# EAGLE schematic TurboMaster (EAGLE 7.6.0)
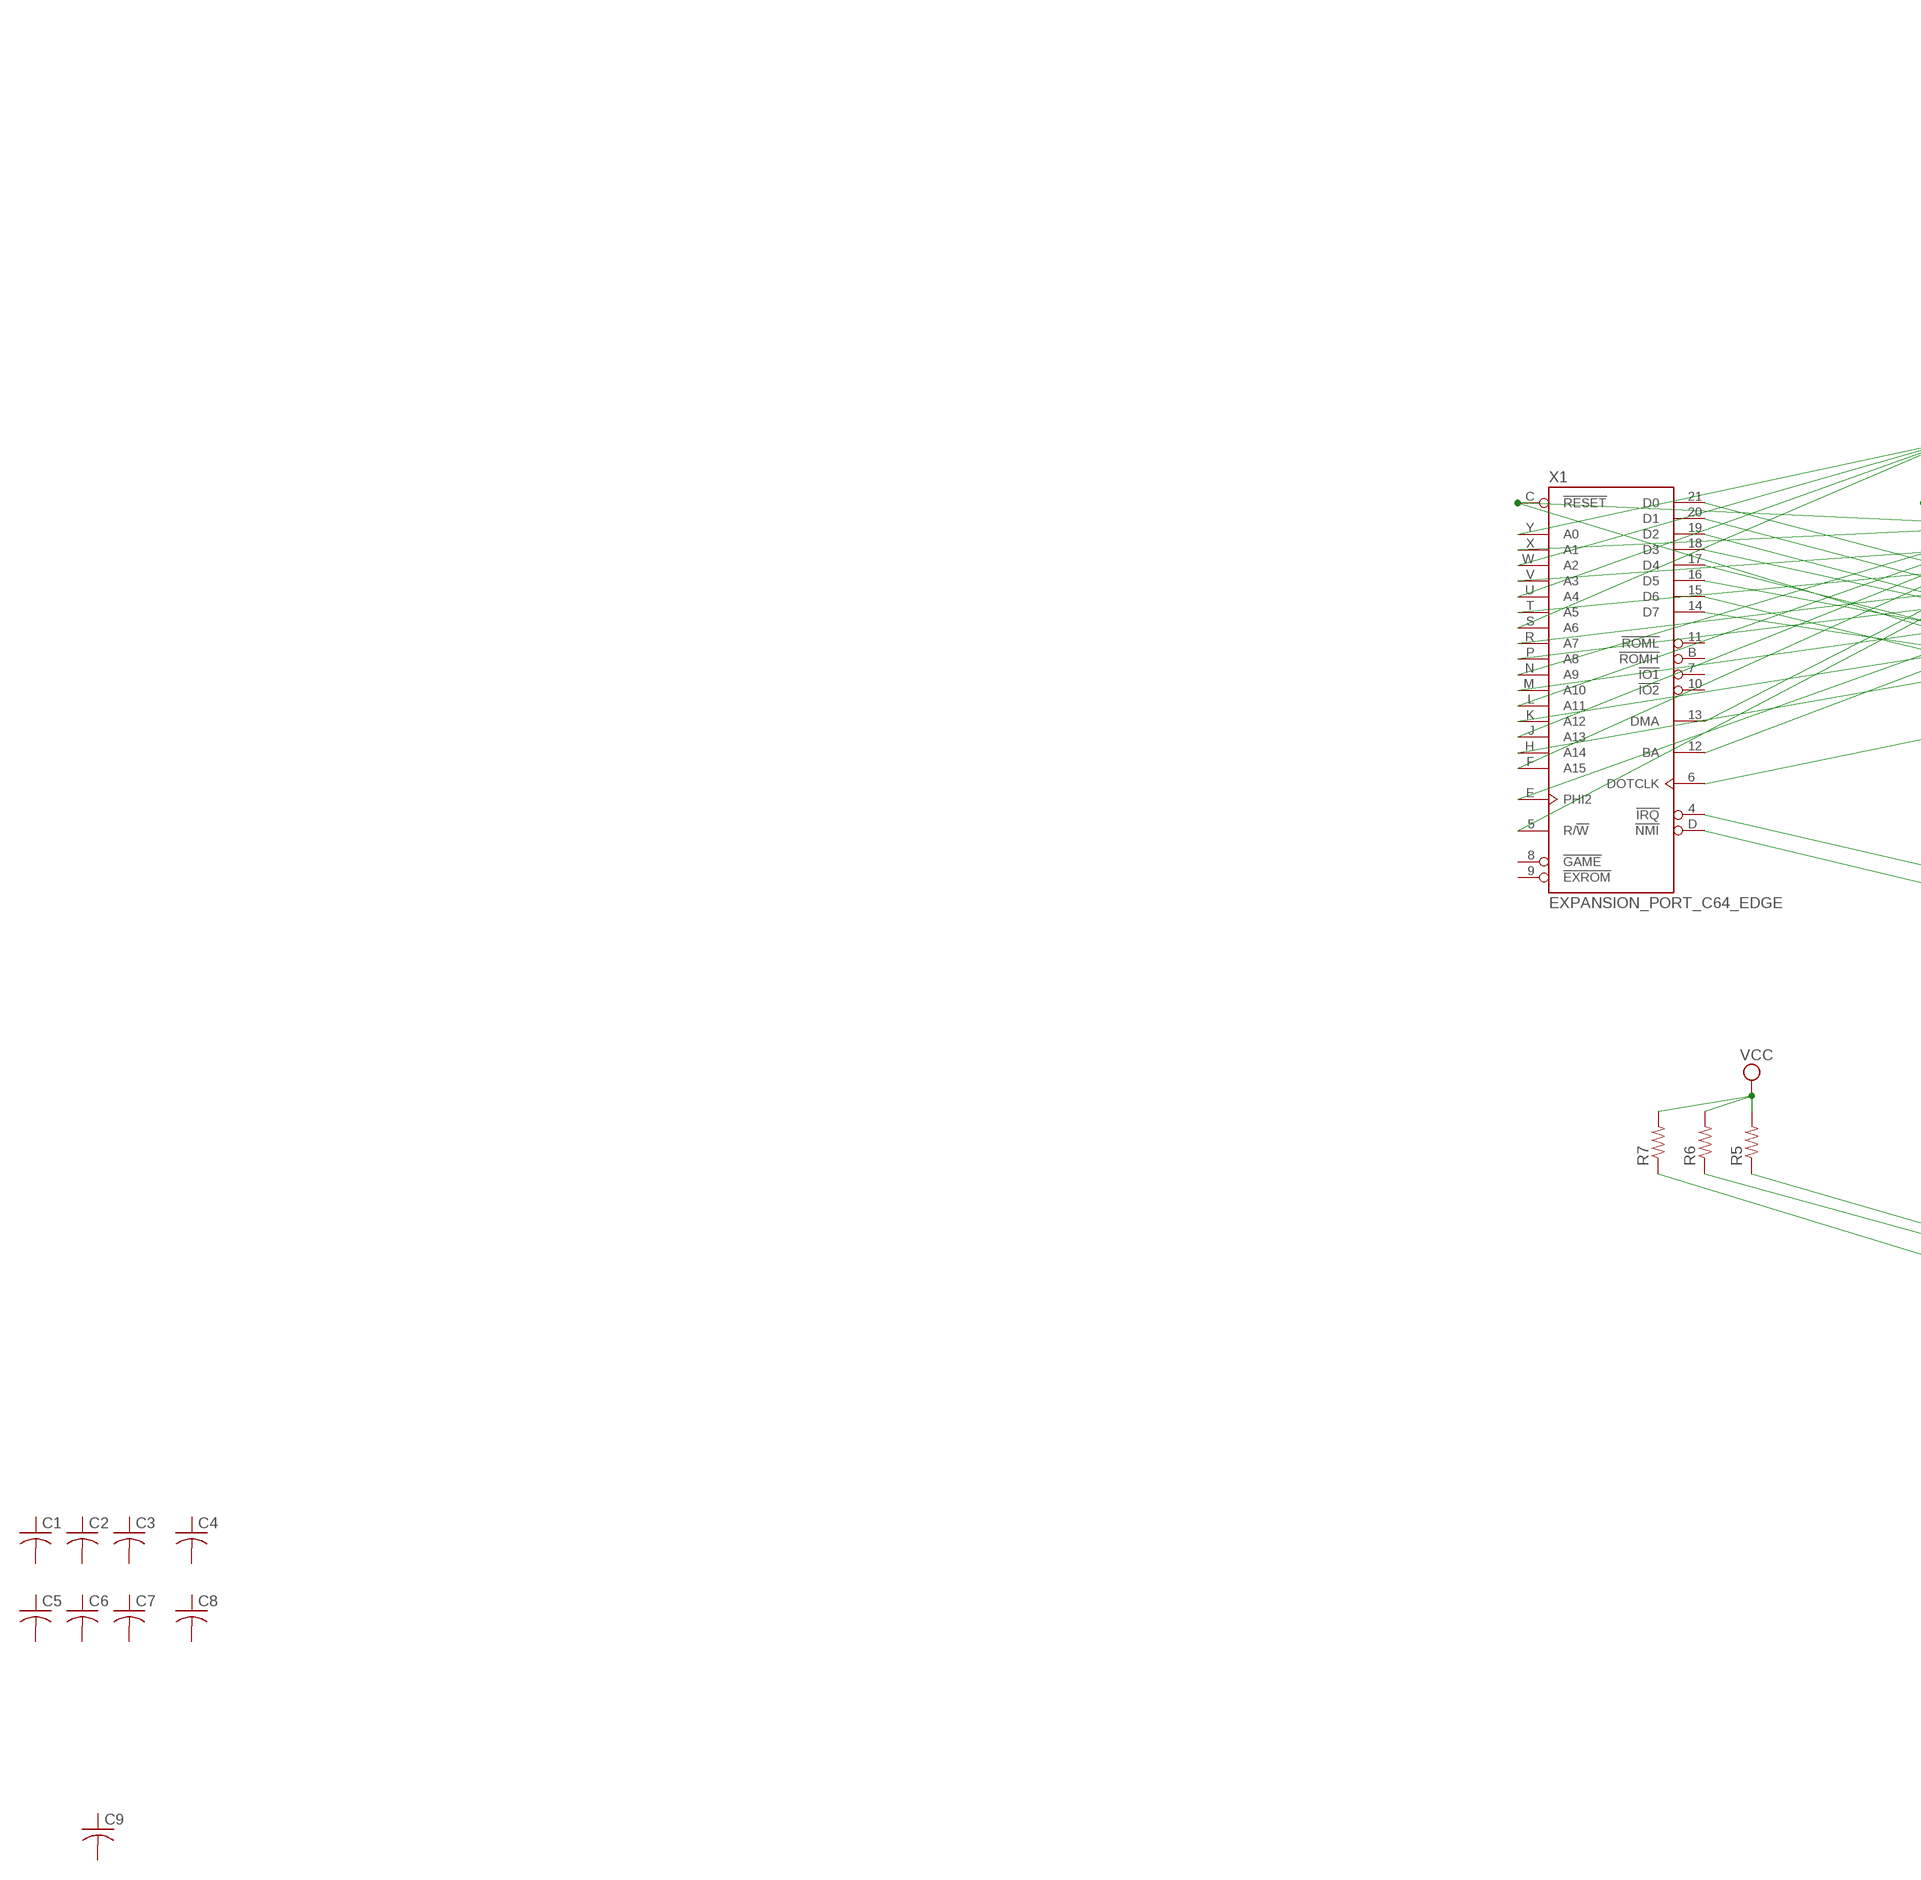
[diagram p0: schematic, sheet 1, part 1 of 2]
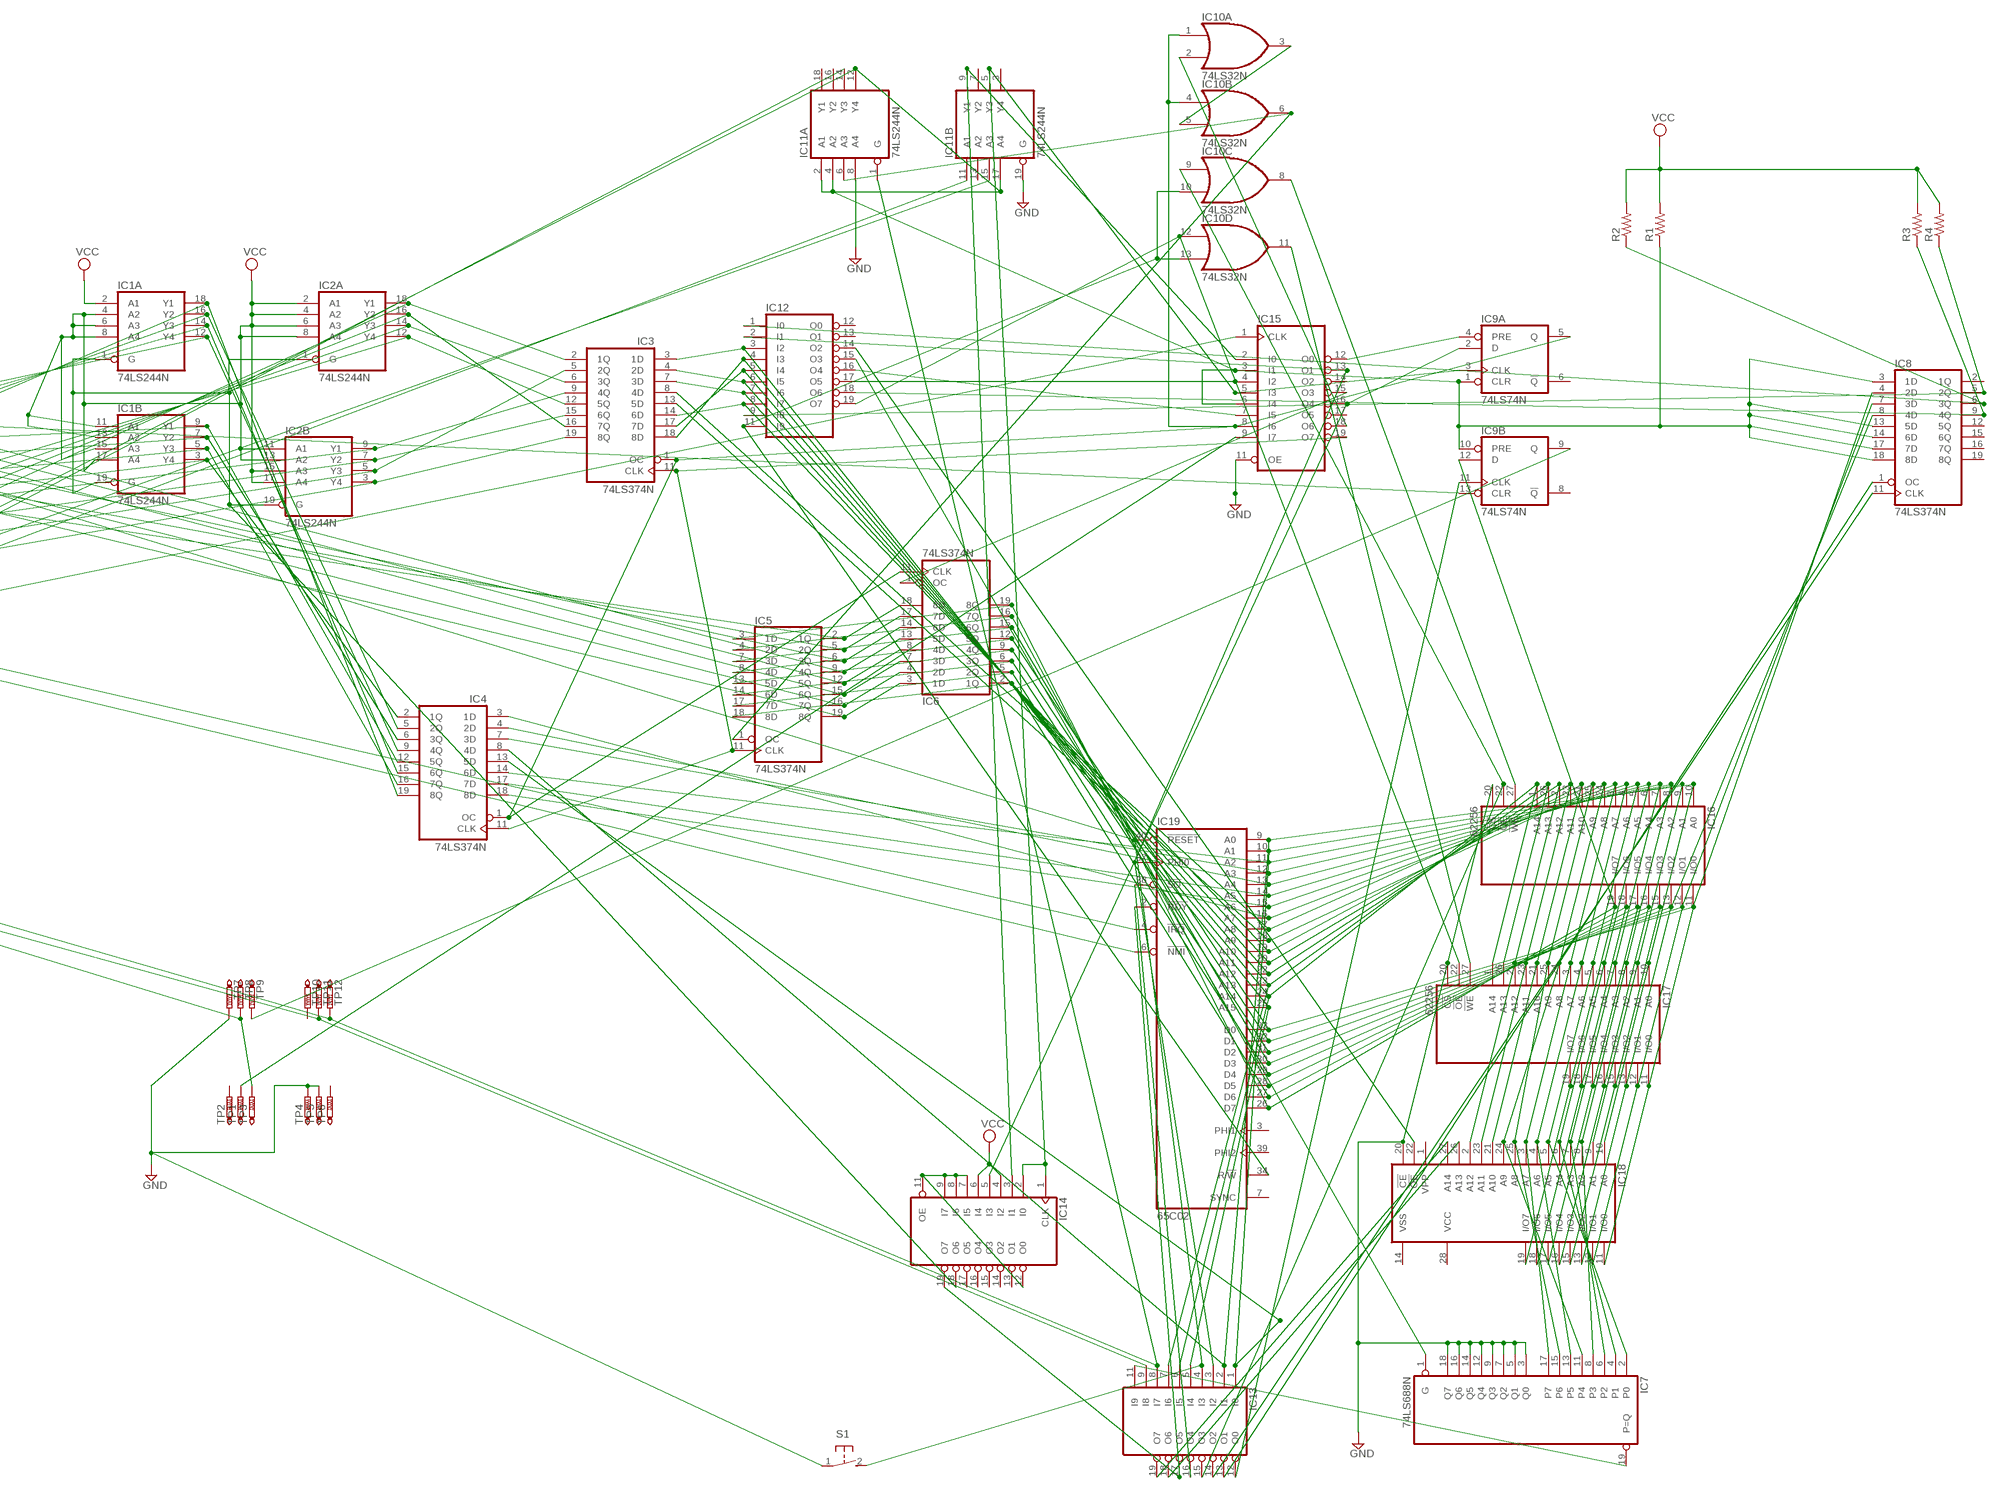
[diagram p1: schematic, sheet 1, part 2 of 2]

## Parts
C1  C-US050-024X044  [C050-024X044]
C2  C-US050-024X044  [C050-024X044]
C3  C-US050-024X044  [C050-024X044]
C4  C-US050-024X044  [C050-024X044]
C5  C-US050-024X044  [C050-024X044]
C6  C-US050-024X044  [C050-024X044]
C7  C-US050-024X044  [C050-024X044]
C8  C-US050-024X044  [C050-024X044]
C9  C-US050-024X044  [C050-024X044]
IC1  74LS244N  [DIL20]
IC2  74LS244N  [DIL20]
IC3  74LS374N  [DIL20]
IC4  74LS374N  [DIL20]
IC5  74LS374N  [DIL20]
IC6  74LS374N  [DIL20]
IC7  74LS688N  [DIL20]
IC8  74LS374N  [DIL20]
IC9  74LS74N  [DIL14]
IC10  74LS32N  [DIL14]
IC11  74LS244N  [DIL20]
IC12  16L8  [DIL20]
IC13  16L8  [DIL20]
IC14  16R4  [DIL20]
IC15  16R6  [DIL20]
IC16  62256  [DIL28]
IC17  62256  [DIL28]
IC18  27C256AG  [DIL28-6]
IC19  65C02  [DIL40]
R1  R-US_0207/10  [0207/10]
R2  R-US_0207/10  [0207/10]
R3  R-US_0207/10  [0207/10]
R4  R-US_0207/10  [0207/10]
R5  R-US_0207/10  [0207/10]
R6  R-US_0207/10  [0207/10]
R7  R-US_0207/10  [0207/10]
S1  31-XX  [B3F-31XX]
TP1  PTR1PAD1-13  [P1-13]
TP2  PTR1PAD1-13  [P1-13]
TP3  PTR1PAD1-13  [P1-13]
TP4  PTR1PAD1-13  [P1-13]
TP5  PTR1PAD1-13  [P1-13]
TP6  PTR1PAD1-13  [P1-13]
TP7  PTR1PAD1-13  [P1-13]
TP8  PTR1PAD1-13  [P1-13]
TP9  PTR1PAD1-13  [P1-13]
TP10  PTR1PAD1-13  [P1-13]
TP11  PTR1PAD1-13  [P1-13]
TP12  PTR1PAD1-13  [P1-13]
X1  EXPANSION_PORT_C64_EDGE  [MA100-22-2]

## Nets
GND: IC7.3(Q0) IC7.5(Q1) IC7.7(Q2) IC7.9(Q3) IC7.12(Q4) IC7.14(Q5) IC7.16(Q6) IC7.18(Q7) IC11.8(A:A4) IC11.19(B:G) IC15.11(OE) IC16.20(!CS) IC17.20(!CS) IC18.20(!CE) S1.1(P) TP4.TP TP5.TP TP7.TP
N$1: IC1.1(A:G) IC1.19(B:G) IC2.1(A:G) IC2.19(B:G) IC14.18(O6)
N$2: IC3.14(6D) IC12.8(I7) IC16.21(A10) IC17.21(A10) IC18.21(A10) IC19.19(A10)
N$3: IC13.17(O5) IC14.19(O7) IC19.2(!RDY)
N$4: IC8.11(CLK) IC13.14(O2)
N$5: IC8.9(4Q) IC12.18(O6) R3.1
N$6: IC4.3(1D) IC7.17(P7) IC16.3(A7) IC17.3(A7) IC18.3(A7) IC19.16(A7)
N$7: IC4.18(8D) IC7.13(P5) IC16.4(A6) IC17.4(A6) IC18.4(A6) IC19.15(A6)
N$8: IC3.8(4D) IC7.15(P6) IC16.25(A9) IC17.25(A9) IC18.25(A8) IC19.17(A8)
N$9: IC4.17(7D) IC7.2(P0) IC16.5(A5) IC17.5(A5) IC18.5(A5) IC19.14(A5)
N$10: IC4.4(2D) IC7.4(P1) IC16.6(A4) IC17.6(A4) IC18.6(A4) IC19.13(A4)
N$11: IC4.7(3D) IC7.6(P2) IC16.7(A3) IC17.7(A3) IC18.7(A3) IC19.12(A3)
N$12: IC4.14(6D) IC7.8(P3) IC16.8(A2) IC17.8(A2) IC18.8(A2) IC19.11(A2)
N$13: IC4.13(5D) IC13.1(I0) IC16.9(A1) IC17.9(A1) IC18.9(A1) IC19.10(A1)
N$14: IC4.8(4D) IC13.2(I1) IC16.10(A0) IC17.10(A0) IC18.10(A0) IC19.9(A0)
N$15: IC5.8(4D) IC6.12(5Q) IC8.4(2D) IC16.11(I/O0) IC17.11(I/O0) IC18.11(I/O0) IC19.33(D0)
N$16: IC5.13(5D) IC6.9(4Q) IC8.7(3D) IC16.12(I/O1) IC17.12(I/O1) IC18.12(I/O1) IC19.32(D1)
N$17: IC5.14(6D) IC6.6(3Q) IC8.8(4D) IC16.13(I/O2) IC17.13(I/O2) IC18.13(I/O2) IC19.31(D2)
N$18: IC5.7(3D) IC6.15(6Q) IC16.15(I/O3) IC17.15(I/O3) IC18.15(I/O3) IC19.30(D3)
N$19: IC5.17(7D) IC6.5(2Q) IC16.16(I/O4) IC17.16(I/O4) IC18.16(I/O4) IC19.29(D4)
N$20: IC5.4(2D) IC6.16(7Q) IC16.17(I/O5) IC17.17(I/O5) IC18.17(I/O5) IC19.28(D5)
N$21: IC5.18(8D) IC6.2(1Q) IC16.18(I/O6) IC17.18(I/O6) IC18.18(I/O6) IC19.27(D6)
N$22: IC5.3(1D) IC6.19(8Q) IC9.12(B:D) IC16.19(I/O7) IC17.19(I/O7) IC18.19(I/O7) IC19.26(D7)
N$23: IC13.18(O6) IC18.26(A13)
N$26: IC3.13(5D) IC7.11(P4) IC16.24(A8) IC17.24(A8) IC18.24(A9) IC19.18(A9)
N$27: IC8.5(2Q) IC12.9(I8) R4.1
N$28: IC13.19(O7) IC18.27(A14)
N$29: IC9.13(B:CLR) IC13.4(I3) IC19.40(!RESET) S1.2(S) X1.C(!RESET)
N$30: IC13.16(O4) IC19.38(!SO)
N$31: IC12.2(I1) IC13.3(I2) IC15.13(O1) IC19.37(PHI0)
N$32: IC5.12(5Q) IC6.8(4D) X1.20(D1)
N$33: IC10.9(C:I0) IC13.15(O3) IC16.22(!OE)
N$34: IC1.12(A:Y4) IC4.9(4Q) X1.Y(A0)
N$35: IC1.9(B:Y1) IC4.12(5Q) X1.X(A1)
N$36: IC1.14(A:Y3) IC4.15(6Q) X1.W(A2)
N$37: IC1.7(B:Y2) IC4.6(3Q) X1.V(A3)
N$38: IC1.16(A:Y2) IC4.5(2Q) X1.U(A4)
N$39: IC1.5(B:Y3) IC4.16(7Q) X1.T(A5)
N$40: IC1.18(A:Y1) IC4.19(8Q) X1.S(A6)
N$41: IC1.3(B:Y4) IC4.2(1Q) X1.R(A7)
N$42: IC2.9(B:Y1) IC3.9(4Q) X1.P(A8)
N$43: IC2.12(A:Y4) IC3.12(5Q) X1.N(A9)
N$44: IC2.7(B:Y2) IC3.15(6Q) X1.M(A10)
N$45: IC2.14(A:Y3) IC3.6(3Q) X1.L(A11)
N$46: IC2.5(B:Y3) IC3.5(2Q) X1.K(A12)
N$47: IC2.16(A:Y2) IC3.16(7Q) X1.J(A13)
N$48: IC2.3(B:Y4) IC3.19(8Q) X1.H(A14)
N$49: IC2.18(A:Y1) IC3.2(1Q) X1.F(A15)
N$50: IC11.15(B:A3) X1.E(PHI2)
N$51: IC19.6(!NMI) X1.D(!NMI)
N$52: R7.1 TP3.TP TP8.TP
N$53: IC19.4(!IRQ) X1.4(!IRQ)
N$54: IC11.14(A:Y3) X1.5(R/!W)
N$55: IC15.1(CLK) X1.6(DOTCLK)
N$56: IC11.11(B:A1) X1.12(BA)
N$57: IC8.3(1D) IC8.13(5D) IC8.14(6D) IC8.17(7D) IC8.18(8D) IC9.1(A:CLR) IC9.10(B:PRE) IC11.2(A:A1) IC11.4(A:A2) IC11.12(A:Y4) IC11.17(B:A4) IC15.3(I1) IC15.6(I4) R1.1 X1.13(DMA)
N$58: IC5.2(1Q) IC6.18(8D) X1.14(D7)
N$59: IC5.19(8Q) IC6.3(1D) X1.15(D6)
N$60: IC5.5(2Q) IC6.17(7D) X1.16(D5)
N$61: IC5.16(7Q) IC6.4(2D) X1.17(D4)
N$62: IC5.6(3Q) IC6.14(6D) X1.18(D3)
N$63: IC5.15(6Q) IC6.7(3D) X1.19(D2)
N$64: IC5.9(4Q) IC6.13(5D) X1.21(D0)
N$65: IC10.3(A:O) IC10.5(B:I1)
N$66: IC5.1(OC) IC10.6(B:O) IC11.6(A:A3)
N$67: IC10.8(C:O) IC16.27(!WE)
N$68: IC10.10(C:I1) IC10.13(D:I1) IC12.11(I9) IC19.34(R/!W)
N$69: IC10.11(D:O) IC17.27(!WE)
N$70: IC11.9(B:Y1) IC14.3(I1) IC15.2(I0)
N$71: IC3.1(OC) IC4.1(OC) IC6.11(CLK) IC9.5(A:Q) IC10.1(A:I0) IC10.4(B:I0) IC15.8(I6)
N$72: IC10.2(A:I1) IC15.18(O6)
N$73: IC9.2(A:D) IC14.5(I3) IC15.16(O4)
N$74: IC10.12(D:I0) IC12.17(O5) IC12.19(O7) IC17.22(!OE)
N$75: IC9.4(A:PRE) IC15.12(O0)
N$76: IC6.1(OC) IC15.15(O3)
N$77: IC9.3(A:CLK) IC11.5(B:Y3) IC14.1(CLK) IC14.2(I0) IC15.5(I3)
N$78: IC12.16(O4) IC15.7(I5)
N$79: IC8.6(3Q) IC12.1(I0) R2.1
N$80: IC15.9(I7) TP1.TP
N$81: IC3.7(3D) IC12.7(I6) IC16.23(A11) IC17.23(A11) IC18.23(A11) IC19.20(A11)
N$82: IC8.1(OC) IC13.13(O1)
N$83: IC7.19(P=Q) IC13.11(I9)
N$84: IC7.1(G) IC12.15(O3)
N$85: IC3.3(1D) IC12.3(I2) IC13.5(I4) IC19.25(A15)
N$86: IC3.18(8D) IC12.4(I3) IC13.6(I5) IC16.1(A14) IC17.1(A14) IC19.24(A14)
N$87: IC3.17(7D) IC12.5(I4) IC13.7(I6) IC16.26(A13) IC17.26(A13) IC19.23(A13)
N$88: IC3.4(2D) IC12.6(I5) IC16.2(A12) IC17.2(A12) IC18.2(A12) IC19.22(A12)
N$89: IC9.11(B:CLK) IC13.12(O0)
N$90: IC14.7(I5) IC14.8(I6) IC14.9(I7) IC14.11(OE) IC14.12(O0)
N$91: IC13.9(I8) R6.1 TP11.TP
N$92: IC9.9(B:Q) TP9.TP
N$93: IC11.1(A:G) IC13.8(I7) R5.1 TP12.TP
N$94: IC3.11(CLK) IC4.11(CLK) IC5.11(CLK) IC15.19(O7)
N$95: IC12.14(O2) IC18.22(!OE)
VCC: IC1.2(A:A1) IC1.4(A:A2) IC1.6(A:A3) IC1.8(A:A4) IC1.11(B:A1) IC1.13(B:A2) IC1.15(B:A3) IC1.17(B:A4) IC2.2(A:A1) IC2.4(A:A2) IC2.6(A:A3) IC2.8(A:A4) IC2.11(B:A1) IC2.13(B:A2) IC2.15(B:A3) IC2.17(B:A4) IC14.4(I2) IC14.6(I4) R1.2 R2.2 R3.2 R4.2 R5.2 R6.2 R7.2
Unconnected: C1.1 C1.2 C2.1 C2.2 C3.1 C3.2 C4.1 C4.2 C5.1 C5.2 C6.1 C6.2 C7.1 C7.2 C8.1 C8.2 C9.1 C9.2 IC8.2(1Q) IC8.12(5Q) IC8.15(6Q) IC8.16(7Q) IC8.19(8Q) IC9.6(A:!Q) IC9.8(B:!Q) IC11.3(B:Y4) IC11.7(B:Y2) IC11.13(B:A2) IC11.16(A:Y2) IC11.18(A:Y1) IC12.12(O0) IC12.13(O1) IC14.13(O1) IC14.14(O2) IC14.15(O3) IC14.16(O4) IC14.17(O5) IC15.4(I2) IC15.14(O2) IC15.17(O5) IC18.1(VPP) IC19.3(PHI1) IC19.7(SYNC) IC19.39(PHI2) TP2.TP TP6.TP TP10.TP X1.7(!IO1) X1.8(!GAME) X1.9(!EXROM) X1.10(!IO2) X1.11(!ROML) X1.B(!ROMH)

## Power pins joined to a net without a drawn wire
GND: IC1.10(P:GND) IC2.10(P:GND) IC3.10(GND) IC4.10(GND) IC5.10(GND) IC6.10(GND) IC7.10(GND) IC8.10(GND) IC9.7(P:GND) IC10.7(P:GND) IC11.10(P:GND) IC12.10(GND) IC13.10(GND) IC14.10(GND) IC15.10(GND) IC16.14(GND) IC17.14(GND) IC19.1(GND) IC19.21(GND) X1.1(GND) X1.22(GND) X1.A(GND) X1.Z(GND)
VCC: IC1.20(P:VCC) IC2.20(P:VCC) IC3.20(VCC) IC4.20(VCC) IC5.20(VCC) IC6.20(VCC) IC7.20(VCC) IC8.20(VCC) IC9.14(P:VCC) IC10.14(P:VCC) IC11.20(P:VCC) IC12.20(VCC) IC13.20(VCC) IC14.20(VCC) IC15.20(VCC) IC16.28(VCC) IC17.28(VCC) IC18.28(VCC) IC19.8(VCC) X1.2(VCC) X1.3(VCC)
VSS: IC18.14(VSS)

## Library data of the parts
C1-C9 = resistor:C-US: CAPACITOR, American symbol
IC1 IC2 IC11 = 74xx-us:74*244: Octal BUFFER and LINE DRIVER, 3-state
IC3-IC6 IC8 = 74xx-us:74*374: Octal D type transparent LATCH, edge triggered
IC7 = 74xx-us:74*688: 8-bit MAGNITUDE/IDENTITY COMPARATOR, totem pole
IC9 = 74xx-us:74*74: Dual D type positive edge triggered FLIP FLOP, preset and clear
IC10 = 74xx-us:74*32: Quad 2-input OR gate
IC12 IC13 = pal:16L8: PAL; MF: TEXAS INSTRUMENTS; MPN: TIBPAL16L8-7CN; OC_FARNELL: 1510033; OC_NEWARK: 08F8522
IC14 = pal:16R4: PAL; MF: TEXAS INSTRUMENTS; MPN: TIBPAL16R4-10CN; OC_FARNELL: 1753788; OC_NEWARK: 08F8524
IC15 = pal:16R6: PAL; MPN: TIBPAL16R6-10CN; OC_FARNELL: 1753789; OC_NEWARK: 90R9355
IC16 IC17 = GIMEchip:62256: 32K*8 SRAM
IC18 = memory-hitachi:27C256AG: MEMORY; OC_FARNELL: unknown; OC_NEWARK: unknown
IC19 = commodore:65*02: 6502 processor
R1-R7 = resistor:R-US_: RESISTOR, American symbol
S1 = switch-omron:31-XX: OMRON SWITCH; MPN: B3F-3100; OC_FARNELL: 959704; OC_NEWARK: 36M3582
TP1-TP12 = testpad:PTR1: TEST PIN
X1 = commodore:EXPANSION_PORT_C64_EDGE